# Altium schematic sheet ETH1G_RGMII_RTL8211F.SchDoc
size A3; SheetNumber: 6; SheetTotal: 22
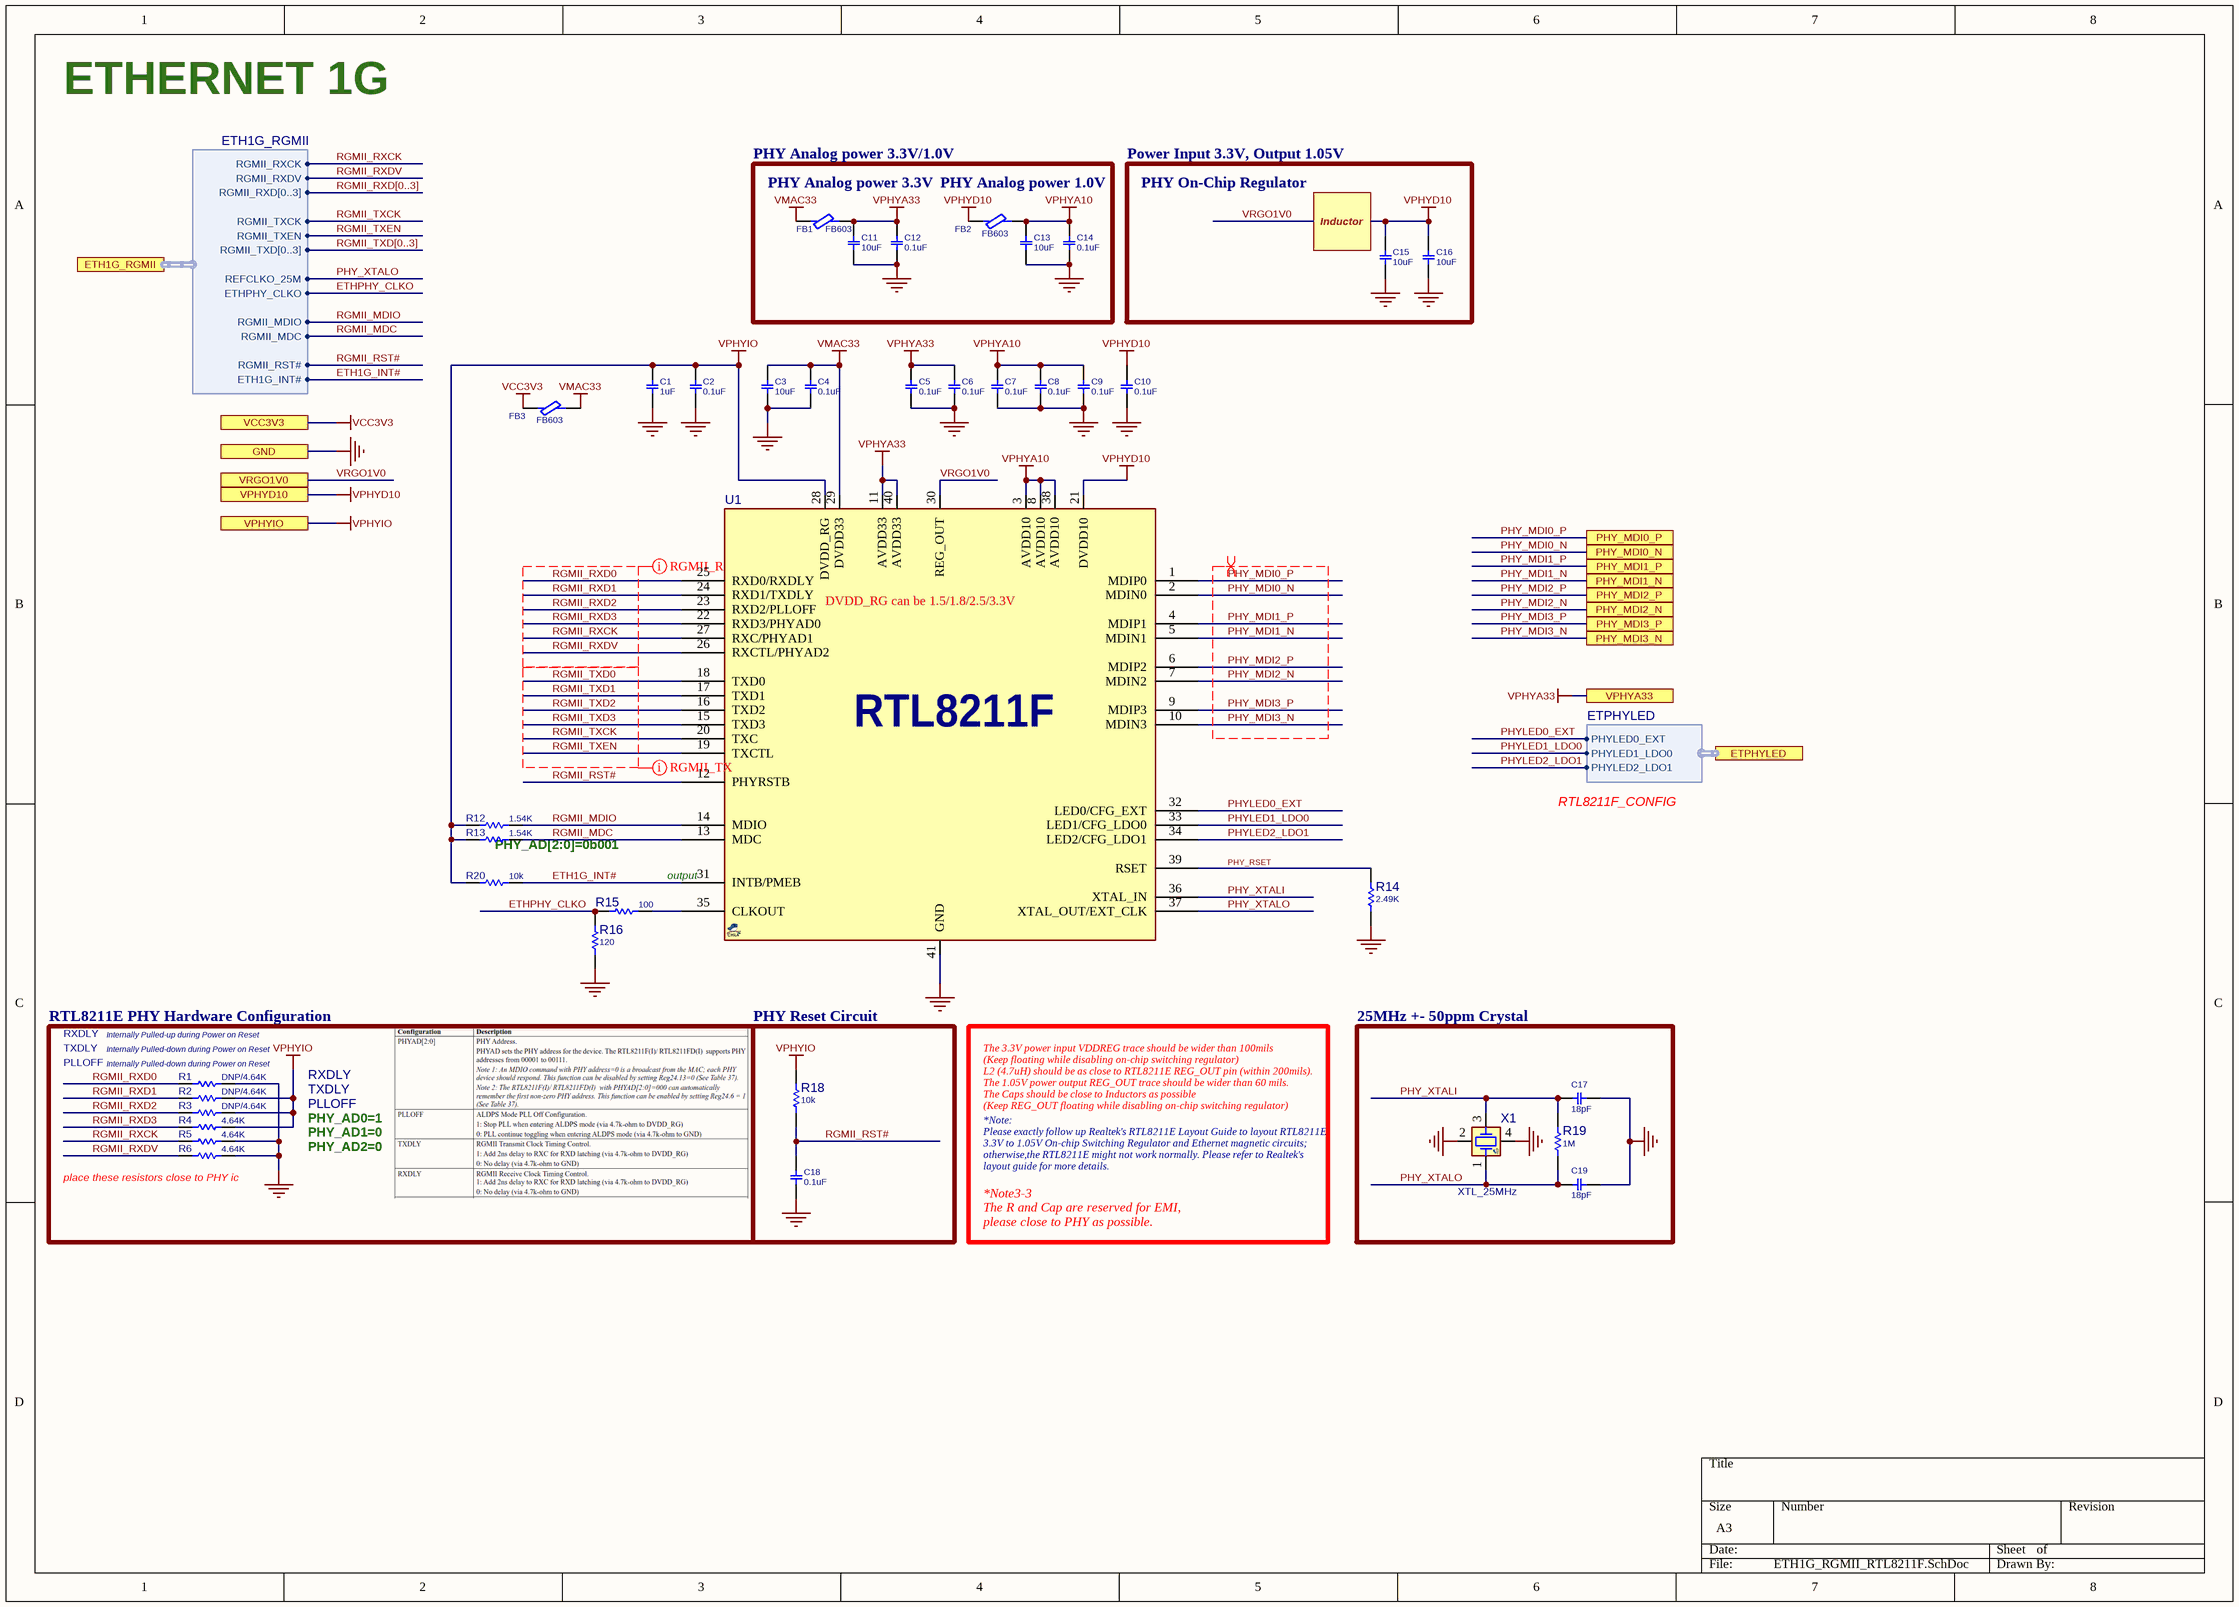
[diagram p0: ETH1G_RGMII_RTL8211F.SchDoc]

## Parts
C1  1uF  [C0402]
C2  0.1uF  [C0402]
C3  10uF  [C0402]
C4  0.1uF  [C0402]
C5  0.1uF  [C0402]
C6  0.1uF  [C0402]
C7  0.1uF  [C0402]
C8  0.1uF  [C0402]
C9  0.1uF  [C0402]
C10  0.1uF  [C0402]
C11  10uF  [C0402]
C12  0.1uF  [C0402]
C13  10uF  [C0402]
C14  0.1uF  [C0402]
C15  10uF  [C0402]
C16  10uF  [C0402]
C17  18pF  [C0402]
C18  0.1uF  [C0402]
C19  18pF  [C0402]
FB1  FB603  [L0603]
FB2  FB603  [L0603]
FB3  FB603  [L0603]
R1  DNP/4.64K  [R0402]
R2  DNP/4.64K  [R0402]
R3  DNP/4.64K  [R0402]
R4  4.64K  [R0402]
R5  4.64K  [R0402]
R6  4.64K  [R0402]
R12  1.54K  [R0402]
R13  1.54K  [R0402]
R14  2.49K  [R0402]
R15  100  [R0402]
R16  120  [R0402]
R18  10k  [R0402]
R19  1M  [R0402]
R20  10k  [R0402]
U1  RTL8211F  [QFN40_40T]  (value not drawn)
X1  XTL_25MHz  [XTL_4_2016]

## Blocks framed on the sheet
RTL8211E PHY Hardware Configuration: R1-R6
PHY Reset Circuit: C18 R18
25MHz +- 50ppm Crystal: C17 C19 R19 X1

## Ports
ETH1G_RGMII (harness ETH1G_RGMII), ETPHYLED (harness ETPHYLED), GND, PHY_MDI0_N, PHY_MDI0_P, PHY_MDI1_N, PHY_MDI1_P, PHY_MDI2_N, PHY_MDI2_P, PHY_MDI3_N, PHY_MDI3_P, VCC3V3, VPHYA33, VPHYD10, VPHYIO, VRGO1V0

## Harnesses
ETH1G_RGMII: RGMII_RXCK, RGMII_RXDV, RGMII_RXD[0..3], RGMII_TXCK, RGMII_TXEN, RGMII_TXD[0..3], REFCLKO_25M, ETHPHY_CLKO, RGMII_MDIO, RGMII_MDC, RGMII_RST#, ETH1G_INT#
ETPHYLED: PHYLED0_EXT, PHYLED1_LDO0, PHYLED2_LDO1

## Nets
GND: C1.1 C2.2 C3.2 C4.2 C5.2 C6.2 C7.2 C8.2 C9.2 C10.2 C11.2 C12.2 C13.2 C14.2 C15.2 C16.2 C17.2 C18.1 C19.2 R1.2 R5.2 R6.2 R14.1 R16.1 U1.41(GND) X1.2(GND1) X1.4(GND2) ; port GND
VCC3V3: FB3.1 ; port VCC3V3
VMAC33: C3.1 C4.1 FB1.1 FB3.2 U1.29(DVDD33)
VPHYA10: C7.1 C8.1 C9.1 C13.1 C14.1 FB2.2 U1.3(AVDD10) U1.8(AVDD10) U1.38(AVDD10)
VPHYA33: C5.1 C6.1 C11.1 C12.1 FB1.2 U1.11(AVDD33) U1.40(AVDD33) ; port VPHYA33
VPHYD10: C10.1 C15.1 C16.1 FB2.1 U1.21(DVDD10) ; port VPHYD10
VPHYIO: C1.2 C2.1 R2.2 R3.2 R4.2 R12.1 R13.1 R18.1 R20.1 U1.28(DVDD_RG) ; port VPHYIO
ETH1G_INT#: R20.2 U1.31(INTB/PMEB) ; port ETH1G_RGMII.ETH1G_INT#
ETHPHY_CLKO: R15.1 R16.2 ; port ETH1G_RGMII.ETHPHY_CLKO
PHY_MDI0_N: U1.2(MDIN0) ; port PHY_MDI0_N
PHY_MDI0_P: U1.1(MDIP0) ; port PHY_MDI0_P
PHY_MDI1_N: U1.5(MDIN1) ; port PHY_MDI1_N
PHY_MDI1_P: U1.4(MDIP1) ; port PHY_MDI1_P
PHY_MDI2_N: U1.7(MDIN2) ; port PHY_MDI2_N
PHY_MDI2_P: U1.6(MDIP2) ; port PHY_MDI2_P
PHY_MDI3_N: U1.10(MDIN3) ; port PHY_MDI3_N
PHY_MDI3_P: U1.9(MDIP3) ; port PHY_MDI3_P
PHY_RSET: R14.2 U1.39(RSET)
PHY_XTALI: C17.1 R19.2 U1.36(XTAL_IN) X1.3(XB)
PHY_XTALO: C19.1 R19.1 U1.37(XTAL_OUT/EXT_CLK) X1.1(XA) ; port ETH1G_RGMII.REFCLKO_25M
PHYLED0_EXT: U1.32(LED0/CFG_EXT) ; port ETPHYLED.PHYLED0_EXT
PHYLED1_LDO0: U1.33(LED1/CFG_LDO0) ; port ETPHYLED.PHYLED1_LDO0
PHYLED2_LDO1: U1.34(LED2/CFG_LDO1) ; port ETPHYLED.PHYLED2_LDO1
RGMII_MDC: R13.2 U1.13(MDC) ; port ETH1G_RGMII.RGMII_MDC
RGMII_MDIO: R12.2 U1.14(MDIO) ; port ETH1G_RGMII.RGMII_MDIO
RGMII_RST#: C18.2 R18.2 U1.12(PHYRSTB) ; port ETH1G_RGMII.RGMII_RST#
RGMII_RXCK: R5.1 U1.27(RXC/PHYAD1) ; port ETH1G_RGMII.RGMII_RXCK
RGMII_RXD0: R1.1 U1.25(RXD0/RXDLY)
RGMII_RXD1: R2.1 U1.24(RXD1/TXDLY)
RGMII_RXD2: R3.1 U1.23(RXD2/PLLOFF)
RGMII_RXD3: R4.1 U1.22(RXD3/PHYAD0)
RGMII_RXDV: R6.1 U1.26(RXCTL/PHYAD2) ; port ETH1G_RGMII.RGMII_RXDV
RGMII_TXCK: U1.20(TXC) ; port ETH1G_RGMII.RGMII_TXCK
RGMII_TXD0: U1.18(TXD0)
RGMII_TXD1: U1.17(TXD1)
RGMII_TXD2: U1.16(TXD2)
RGMII_TXD3: U1.15(TXD3)
RGMII_TXEN: U1.19(TXCTL) ; port ETH1G_RGMII.RGMII_TXEN
VRGO1V0: U1.30(REG_OUT) ; port VRGO1V0
NetR15_2: R15.2 U1.35(CLKOUT)

## Buses and harness runs
bus RGMII_RXD[0..3]
bus RGMII_TXD[0..3]

## Layout directives
differential pair: PHY_MDI0_N, PHY_MDI0_P, PHY_MDI1_N, PHY_MDI1_P, PHY_MDI2_N, PHY_MDI2_P, PHY_MDI3_N, PHY_MDI3_P
net class RGMII_RX: RGMII_RXCK, RGMII_RXD0, RGMII_RXD1, RGMII_RXD2, RGMII_RXD3, RGMII_RXDV
net class RGMII_TX: RGMII_TXCK, RGMII_TXD0, RGMII_TXD1, RGMII_TXD2, RGMII_TXD3, RGMII_TXEN

## Notes on the sheet
- ETHERNET 1G
- PHY Analog power 3.3V/1.0V
- PHY Analog power 3.3V
- PHY Analog power 1.0V
- Power Input 3.3V, Output 1.05V
- PHY On-Chip Regulator
- (near C15) Inductor
- (near U1) DVDD_RG can be 1.5/1.8/2.5/3.3V
- RTL8211F_CONFIG
- (near R13) PHY_AD[2:0]=0b001
- output
- RXDLY
- TXDLY
- Internally Pulled-up during Power on Reset
- Internally Pulled-down during Power on Reset
- PLLOFF
- (near R1) Internally Pulled-down during Power on Reset
- PHY_AD0=1
- The 3.3V power input VDDREG trace should be wider than 100mils
  (Keep floating while disabling on-chip switching regulator)
  L2 (4.7uH) should be as close to RTL8211E REG_OUT pin (within 200mils).
  The 1.05V power output REG_OUT trace should be wider than 60 mils.
  The Caps should be close to Inductors as possible
  (Keep REG_OUT floating while disabling on-chip switching regulator)
- (near R6) place these resistors close to PHY ic
- PHY_AD1=0
- PHY_AD2=0
- *Note:
  Please exactly follow up Realtek's RTL8211E Layout Guide to layout RTL8211E 3.3V to 1.05V On-chip Switching Regulator and Ethernet magnetic circuits;
  otherwise,the RTL8211E might not work normally. Please refer to Realtek's layout guide for more details.
- *Note3-3
  The R and Cap are reserved for EMI, please close to PHY as possible.

## Library data of the parts
C1 = CAP_SMD_MLCC: CAP, MLCC; PARAM: X5R, 10%; MANF_P#: CL05A105KO5NNND; MANF: Samsung; PARAM2: 16v; PRICE: 50,000:	$0.006; ASSEMBLY: ASSEMBLY; VALUE: 1uF
C2 C4-C10 C12 C14 C18 = CAP_SMD_MLCC_100n50T: CAP, MLCC; PARAM: X5R, 10%; MANF_P#: GRM155R61E104; MANF: Murata; PARAM2: 25v; ASSEMBLY: ASSEMBLY; PRICE: 10,000:$0.006; VALUE: 0.1uF
C3 C11 C13 C15 C16 = CAP_SMD_MLCC_100n50T: CAP, MLCC; PARAM: X5R, 20%; MANF_P#: CL05A106MP5NUNC; MANF: Samsung; PARAM2: 10v; ASSEMBLY: ASSEMBLY; PRICE: 10,000: $0.034; VALUE: 10uF
C17 C19 = CAP_SMD_MLCC_100n50T: CAP, MLCC; PARAM: C0G, 5%; MANF_P#: CC0402JRNPO9BN180; MANF: Yageo; PARAM2: 50v; ASSEMBLY: ASSEMBLY; PRICE: 100: 0.009$; VALUE: 18pF
FB1-FB3 = FBEAD_SMD_MPZ1608S102: FERRITE_Bead, 0603, 0.8A, 300mOhm, 1000@100MHz; MANF: MURATA; PARAM: 600@100MHz; PARAM2: 1.3A, 150mOhm; MANF_P#: BLM18KG601SN1D; PRICE: 0.1$; VALUE: FB603
R1-R6 R12-R16 R18-R20 = RES_SMD_10K_0402: RESISTOR, SMD; PARAM: 0.063W; DESC: DESCRIPTION; DIST#: MOUSER; PARAM2: 1%; MANF: -; ASSEMBLY: ASSEMBLY; PRICE: 100= 0.3$; MANF_P#: -
  R1-R3: VALUE: DNP/4.64K
  R4-R6: VALUE: 4.64K
  R12 R13: VALUE: 1.54K
  R14: VALUE: 2.49K
  R15: VALUE: 100
  R16: VALUE: 120
  R18 R20: VALUE: 10k
  R19: VALUE: 1M
U1 = RTL8211F_QFN40: Ethernet Transceiver, 10/100/1000, RGMII; PARAM2: 2.5VIO (3.3V TOL), 3.3&1.8&1.2; PARAM: 0~65oC; MANF_P#: RTL8211FI-CG; MANF: Realtek; PRICE: 2$; DESC: RTL8211FI-CG; ASSEMBLY: *; VALUE: RTL8211F
X1 = XTL_4_25MHz_3225: CRYSTAL 25.00 MHZ 6pF, 10PPM; MANF: Murata; DESC: DESCRIPTION; DIST#: MOUSER; PARAM2: PARAM; MANF_P#: XRCGB25M000F1H00R0; ASSEMBLY: ASSEMBLY; PARAM: 10PPM; PRICE: 0.5$; VALUE: XTL_25MHz